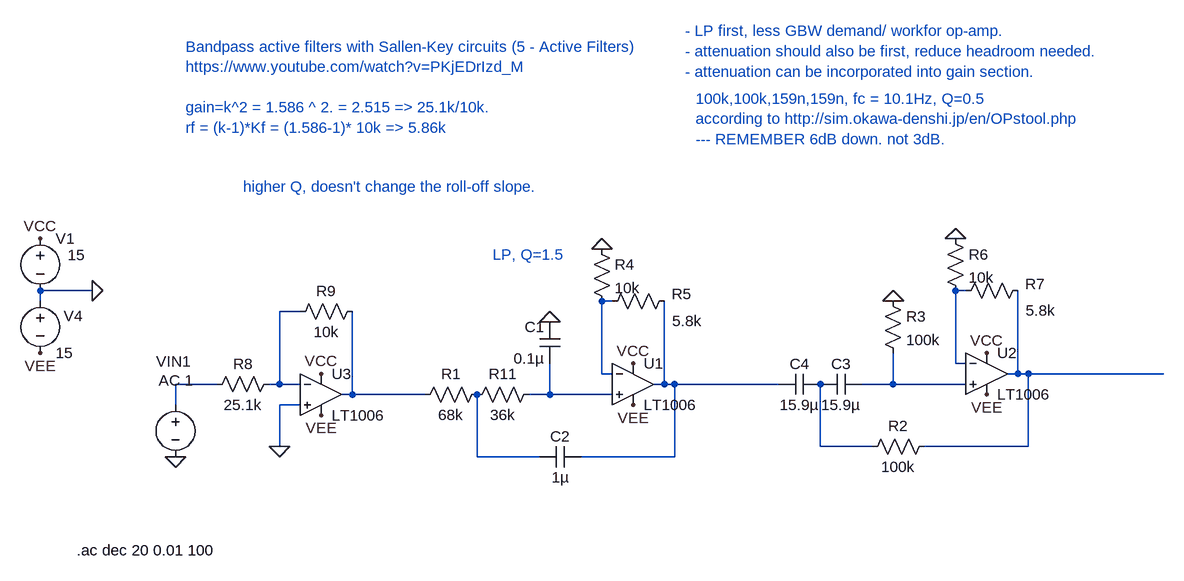
[diagram p0: schematic Draft08.asc]
Draft08.asc, the LTspice schematic file:
Version 4
SHEET 1 2756 2104
WIRE -672 -544 -752 -544
WIRE 672 -544 656 -544
WIRE -752 -528 -752 -544
WIRE 128 -528 112 -528
WIRE -352 -512 -384 -512
WIRE 656 -432 656 -544
WIRE 672 -432 656 -432
WIRE 112 -416 112 -528
WIRE 128 -416 112 -416
WIRE 752 -416 752 -544
WIRE 752 -416 736 -416
WIRE 768 -416 752 -416
WIRE 976 -416 768 -416
WIRE -480 -400 -544 -400
WIRE -384 -400 -384 -512
WIRE -384 -400 -400 -400
WIRE -352 -400 -384 -400
WIRE 208 -400 208 -528
WIRE 208 -400 192 -400
WIRE 224 -400 208 -400
WIRE 384 -400 224 -400
WIRE 560 -400 560 -448
WIRE 560 -400 512 -400
WIRE 672 -400 560 -400
WIRE -272 -384 -272 -512
WIRE -272 -384 -288 -384
WIRE -160 -384 -272 -384
WIRE 32 -384 32 -432
WIRE 32 -384 0 -384
WIRE 128 -384 32 -384
WIRE -544 -368 -544 -400
WIRE -352 -368 -384 -368
WIRE -384 -304 -384 -368
WIRE 448 -304 448 -400
WIRE 528 -304 448 -304
WIRE 768 -304 768 -416
WIRE 768 -304 608 -304
WIRE -80 -288 -80 -384
WIRE 16 -288 -80 -288
WIRE 224 -288 224 -400
WIRE 224 -288 80 -288
FLAG -752 -624 VCC
FLAG -752 -448 VEE
FLAG 160 -432 VCC
FLAG 160 -368 VEE
FLAG -672 -544 0
FLAG 32 -496 0
FLAG -544 -288 0
FLAG 704 -448 VCC
FLAG 704 -384 VEE
FLAG 560 -528 0
FLAG 112 -608 0
FLAG 656 -624 0
FLAG -320 -416 VCC
FLAG -320 -352 VEE
FLAG -384 -304 0
SYMBOL voltage -752 -640 R0
WINDOW 123 0 0 Left 0
WINDOW 39 0 0 Left 0
WINDOW 3 42 41 Left 2
SYMATTR Value 15
SYMATTR InstName V1
SYMBOL voltage -752 -544 R0
WINDOW 123 0 0 Left 0
WINDOW 39 0 0 Left 0
WINDOW 0 36 39 Left 2
SYMATTR InstName V4
SYMATTR Value 15
SYMBOL res -96 -368 R270
WINDOW 0 32 56 VTop 2
WINDOW 3 0 56 VBottom 2
SYMATTR InstName R11
SYMATTR Value 36k
SYMBOL OpAmps\\LT1006 160 -464 R0
SYMATTR InstName U1
SYMBOL res -176 -368 R270
WINDOW 0 32 56 VTop 2
WINDOW 3 0 56 VBottom 2
SYMATTR InstName R1
SYMATTR Value 68k
SYMBOL cap 80 -304 R90
WINDOW 0 0 32 VBottom 2
WINDOW 3 32 32 VTop 2
SYMATTR InstName C2
SYMATTR Value 1µ
SYMBOL cap 48 -432 R180
WINDOW 0 24 56 Left 2
WINDOW 3 24 8 Left 2
SYMATTR InstName C1
SYMATTR Value 0.1µ
SYMBOL voltage -544 -384 R0
WINDOW 123 -26 -22 Left 2
WINDOW 39 0 0 Left 0
WINDOW 3 -341 151 Left 2
WINDOW 0 -30 -51 Left 2
SYMATTR Value2 AC 1
SYMATTR Value ""
SYMATTR InstName VIN1
SYMBOL res 512 -288 R270
WINDOW 0 32 56 VTop 2
WINDOW 3 0 56 VBottom 2
SYMATTR InstName R2
SYMATTR Value 100k
SYMBOL OpAmps\\LT1006 704 -480 R0
SYMATTR InstName U2
SYMBOL res 544 -544 R0
SYMATTR InstName R3
SYMATTR Value 100k
SYMBOL cap 448 -384 R270
WINDOW 0 32 32 VTop 2
WINDOW 3 0 32 VBottom 2
SYMATTR InstName C3
SYMATTR Value 15.9µ
SYMBOL cap 384 -384 R270
WINDOW 0 32 32 VTop 2
WINDOW 3 0 32 VBottom 2
SYMATTR InstName C4
SYMATTR Value 15.9µ
SYMBOL res 96 -624 R0
SYMATTR InstName R4
SYMATTR Value 10k
SYMBOL res 224 -544 R90
WINDOW 0 21 -11 VBottom 2
WINDOW 3 31 -19 VTop 2
SYMATTR InstName R5
SYMATTR Value 5.8k
SYMBOL res 640 -640 R0
SYMATTR InstName R6
SYMATTR Value 10k
SYMBOL res 768 -560 R90
WINDOW 0 21 -11 VBottom 2
WINDOW 3 31 -19 VTop 2
SYMATTR InstName R7
SYMATTR Value 5.8k
SYMBOL OpAmps\\LT1006 -320 -448 R0
SYMATTR InstName U3
SYMBOL res -496 -384 R270
WINDOW 0 32 56 VTop 2
WINDOW 3 0 56 VBottom 2
SYMATTR InstName R8
SYMATTR Value 25.1k
SYMBOL res -368 -496 R270
WINDOW 0 32 56 VTop 2
WINDOW 3 0 56 VBottom 2
SYMATTR InstName R9
SYMATTR Value 10k
TEXT -696 -144 Left 2 !.ac dec 20 0.01 100
TEXT 256 -840 Left 2 ;100k,100k,159n,159n, fc = 10.1Hz, Q=0.5\naccording to http://sim.okawa-denshi.jp/en/OPstool.php\n--- REMEMBER 6dB down. not 3dB.
TEXT 240 -944 Left 2 ;- LP first, less GBW demand/ workfor op-amp.\n- attenuation should also be first, reduce headroom needed.\n- attenuation can be incorporated into gain section.
TEXT -528 -920 Left 2 ;Bandpass active filters with Sallen-Key circuits (5 - Active Filters)\nhttps://www.youtube.com/watch?v=PKjEDrIzd_M \n \ngain=k^2 = 1.586 ^ 2. = 2.515 => 25.1k/10k.\nrf = (k-1)*Kf = (1.586-1)* 10k => 5.86k
TEXT -56 -600 Left 2 ;LP, Q=1.5
TEXT -440 -704 Left 2 ;higher Q, doesn't change the roll-off slope.

The netlist it stands for:
* Draft08.asc
V1 VCC 0 15
V4 0 VEE 15
R11 N011 N009 36k
XU1 N009 N002 VCC VEE N006 LT1006  ; pins In+ In- V+ V- OUT
R1 N008 N011 68k
C2 N006 N011 1µ
C1 N009 0 0.1µ
VIN1 N005 0 AC 1
R2 N010 N004 100k
XU2 N007 N001 VCC VEE N004 LT1006  ; pins In+ In- V+ V- OUT
R3 0 N007 100k
C3 N010 N007 15.9µ
C4 N006 N010 15.9µ
R4 0 N002 10k
R5 N006 N002 5.8k
R6 0 N001 10k
R7 N004 N001 5.8k
XU3 0 N003 VCC VEE N008 LT1006  ; pins In+ In- V+ V- OUT
R8 N005 N003 25.1k
R9 N003 N008 10k
.ac dec 20 0.01 100
* 100k,100k,159n,159n, fc = 10.1Hz, Q=0.5
* according to http://sim.okawa-denshi.jp/en/OPstool.php
* --- REMEMBER 6dB down. not 3dB.
* - LP first, less GBW demand/ workfor op-amp.
* - attenuation should also be first, reduce headroom needed.
* - attenuation can be incorporated into gain section.
* Bandpass active filters with Sallen-Key circuits (5 - Active Filters)
* https://www.youtube.com/watch?v=PKjEDrIzd_M
* gain=k^2 = 1.586 ^ 2. = 2.515 => 25.1k/10k.
* rf = (k-1)*Kf = (1.586-1)* 10k => 5.86k
* LP, Q=1.5
* higher Q, doesn't change the roll-off slope.
.lib LTC.lib
.backanno
.end